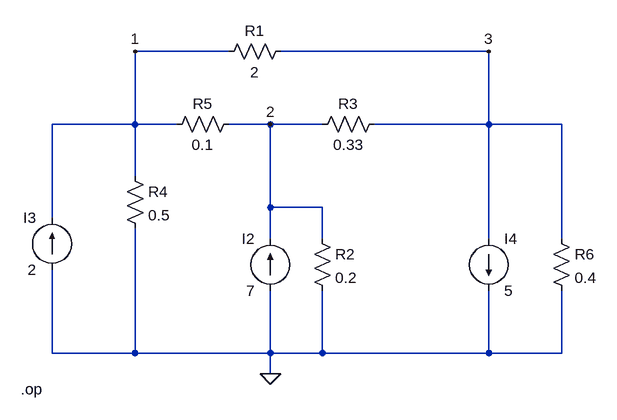
[diagram p0: schematic example.asc]
example.asc, the LTspice schematic file:
Version 4
SHEET 1 880 680
WIRE 160 64 16 64
WIRE 560 64 240 64
WIRE 16 176 16 64
WIRE 16 176 -112 176
WIRE 80 176 16 176
WIRE 224 176 160 176
WIRE 304 176 224 176
WIRE 560 176 560 64
WIRE 560 176 384 176
WIRE 672 176 560 176
WIRE 16 256 16 176
WIRE 224 304 224 176
WIRE 304 304 224 304
WIRE -112 320 -112 176
WIRE 224 352 224 304
WIRE 304 352 304 304
WIRE 560 352 560 176
WIRE 672 352 672 176
WIRE -112 528 -112 400
WIRE 16 528 16 336
WIRE 16 528 -112 528
WIRE 224 528 224 432
WIRE 224 528 16 528
WIRE 304 528 304 432
WIRE 304 528 224 528
WIRE 560 528 560 432
WIRE 560 528 304 528
WIRE 672 528 672 432
WIRE 672 528 560 528
WIRE 224 560 224 528
FLAG 224 560 0
FLAG 16 64 1
FLAG 224 176 2
FLAG 560 64 3
SYMBOL res 256 48 R90
WINDOW 0 0 56 VBottom 2
WINDOW 3 32 56 VTop 2
SYMATTR InstName R1
SYMATTR Value 2
SYMBOL current 224 432 R180
WINDOW 0 24 80 Left 2
WINDOW 3 24 0 Left 2
WINDOW 123 0 0 Left 0
WINDOW 39 0 0 Left 0
SYMATTR InstName I2
SYMATTR Value 7
SYMBOL res 288 336 R0
SYMATTR InstName R2
SYMATTR Value 0.2
SYMBOL res 400 160 R90
WINDOW 0 0 56 VBottom 2
WINDOW 3 32 56 VTop 2
SYMATTR InstName R3
SYMATTR Value 0.33
SYMBOL res 0 240 R0
SYMATTR InstName R4
SYMATTR Value 0.5
SYMBOL current -112 400 R180
WINDOW 0 24 80 Left 2
WINDOW 3 24 0 Left 2
WINDOW 123 0 0 Left 0
WINDOW 39 0 0 Left 0
SYMATTR InstName I3
SYMATTR Value 2
SYMBOL current 560 352 R0
WINDOW 123 0 0 Left 0
WINDOW 39 0 0 Left 0
SYMATTR InstName I4
SYMATTR Value 5
SYMBOL res 176 160 R90
WINDOW 0 0 56 VBottom 2
WINDOW 3 32 56 VTop 2
SYMATTR InstName R5
SYMATTR Value 0.1
SYMBOL res 656 336 R0
SYMATTR InstName R6
SYMATTR Value 0.4
TEXT -160 584 Left 2 !.op

The netlist it stands for:
* example.asc
R1 3 1 2
I2 0 2 7
R2 2 0 0.2
R3 3 2 0.33
R4 1 0 0.5
I3 0 1 2
I4 3 0 5
R5 2 1 0.1
R6 3 0 0.4
.op
.backanno
.end